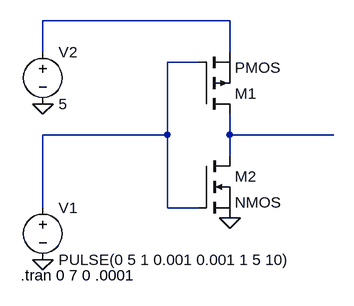
[diagram p0: schematic LTSPICE_NOT_GATE.asc]
LTSPICE_NOT_GATE.asc, the LTspice schematic file:
Version 4
SHEET 1 880 680
WIRE 336 48 48 48
WIRE 48 96 48 48
WIRE 336 96 336 48
WIRE 288 112 240 112
WIRE 240 224 240 112
WIRE 240 224 48 224
WIRE 336 224 336 192
WIRE 496 224 336 224
WIRE 336 256 336 224
WIRE 48 336 48 224
WIRE 240 336 240 224
WIRE 288 336 240 336
FLAG 48 176 0
FLAG 48 416 0
FLAG 336 352 0
SYMBOL voltage 48 80 R0
SYMATTR InstName V2
SYMATTR Value 5
SYMBOL voltage 48 320 R0
WINDOW 123 0 0 Left 2
WINDOW 39 0 0 Left 2
SYMATTR InstName V1
SYMATTR Value PULSE(0 5 1 0.001 0.001 1 5 10)
SYMBOL nmos 288 256 R0
SYMATTR InstName M2
SYMBOL pmos 288 192 M180
SYMATTR InstName M1
TEXT 14 440 Left 2 !.tran 0 7 0 .0001

The netlist it stands for:
* LTSPICE_NOT_GATE.asc
V2 N001 0 5
V1 N002 0 PULSE(0 5 1 0.001 0.001 1 5 10)
M2 N003 N002 0 0 NMOS
M1 N003 N002 N001 N001 PMOS
.model NMOS NMOS
.model PMOS PMOS
.lib standard.mos
.tran 0 7 0 .0001
.backanno
.end